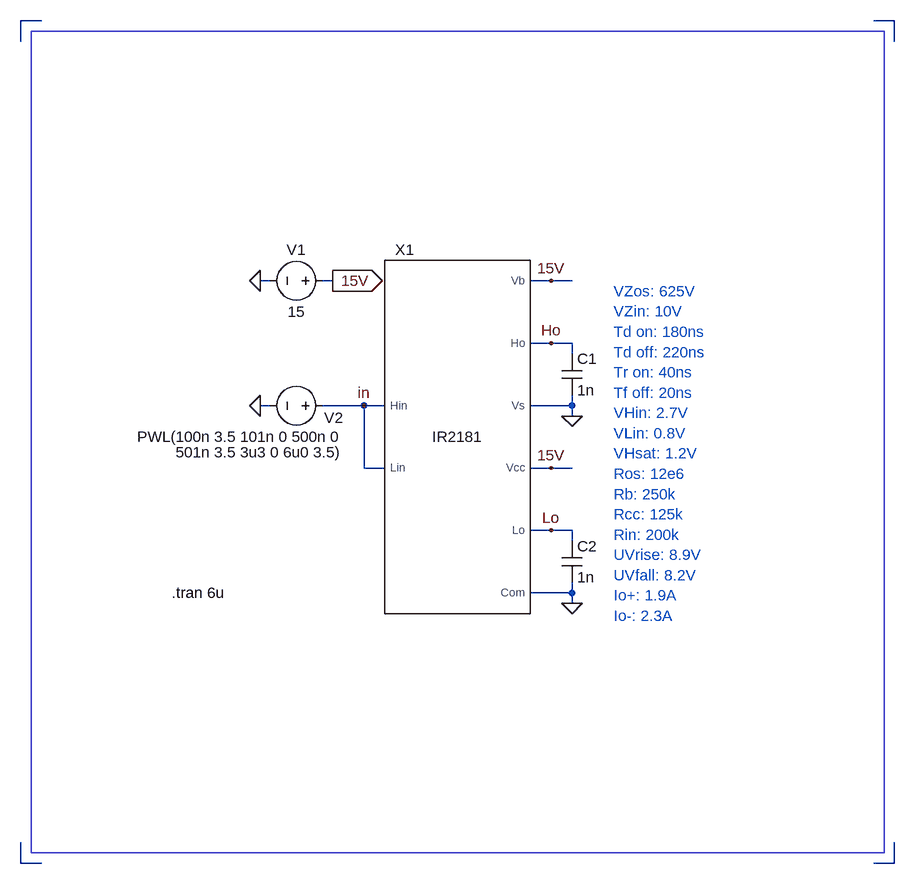
[diagram p0: schematic IR2181_test.asc]
IR2181_test.asc, the LTspice schematic file:
Version 4
SHEET 1 13828 1048
WIRE 752 -752 752 -784
WIRE 752 512 752 480
WIRE 784 -784 752 -784
WIRE 784 512 752 512
WIRE 1136 -384 1120 -384
WIRE 1136 -192 1120 -192
WIRE 1232 -384 1216 -384
WIRE 1280 -192 1216 -192
WIRE 1280 -96 1280 -192
WIRE 1312 -192 1280 -192
WIRE 1312 -96 1280 -96
WIRE 1568 -384 1536 -384
WIRE 1568 -288 1536 -288
WIRE 1568 -96 1536 -96
WIRE 1568 0 1536 0
WIRE 1600 -384 1568 -384
WIRE 1600 -288 1568 -288
WIRE 1600 -272 1600 -288
WIRE 1600 -192 1536 -192
WIRE 1600 -192 1600 -208
WIRE 1600 -176 1600 -192
WIRE 1600 -96 1568 -96
WIRE 1600 0 1568 0
WIRE 1600 16 1600 0
WIRE 1600 96 1536 96
WIRE 1600 96 1600 80
WIRE 1600 112 1600 96
WIRE 2096 -784 2064 -784
WIRE 2096 -752 2096 -784
WIRE 2096 512 2064 512
WIRE 2096 512 2096 480
FLAG 1600 -176 0
FLAG 1568 -288 Ho
FLAG 1600 112 0
FLAG 1568 0 Lo
FLAG 1568 -384 15V
FLAG 1568 -96 15V
FLAG 1232 -384 15V
IOPIN 1232 -384 Out
FLAG 1120 -384 0
FLAG 1120 -192 0
FLAG 1280 -192 in
SYMBOL cap 1584 -272 R0
SYMATTR InstName C1
SYMATTR Value 1n
SYMBOL cap 1584 16 R0
SYMATTR InstName C2
SYMATTR Value 1n
SYMBOL voltage 1232 -384 R90
WINDOW 0 -32 56 VBottom 0
WINDOW 3 32 56 VTop 0
SYMATTR InstName V1
SYMATTR Value 15
SYMBOL IR2181 1424 -144 R0
SYMATTR InstName X1
SYMBOL voltage 1232 -192 R90
WINDOW 0 19 -16 VRight 0
WINDOW 3 48 -16 VRight 0
WINDOW 123 72 -16 VRight 0
SYMATTR InstName V2
SYMATTR Value PWL(100n 3.5 101n 0 500n 0
SYMATTR Value2 501n 3.5 3u3 0 6u0 3.5)
TEXT 1664 -368 Left 0 ;VZos: 625V\nVZin: 10V\nTd on: 180ns\nTd off: 220ns\nTr on: 40ns\nTf off: 20ns\nVHin: 2.7V\nVLin: 0.8V\nVHsat: 1.2V\nRos: 12e6\nRb: 250k\nRcc: 125k\nRin: 200k\nUVrise: 8.9V\nUVfall: 8.2V\nIo+: 1.9A\nIo-: 2.3A
TEXT 984 96 Left 0 !.tran 6u
RECTANGLE Normal 2080 496 768 -768

The netlist it stands for:
* IR2181_test.asc
C1 Ho 0 1n
C2 Lo 0 1n
V1 15V 0 15
XX1 in in 0 Lo 15V 0 Ho 15V IR2181 params: IR2181  ; pins Hin Lin Com Lo Vcc Vs Ho Vb
V2 in 0 PWL(100n 3.5 101n 0 500n 0 501n 3.5 3u3 0 6u0 3.5)
* VZos: 625V
* VZin: 10V
* Td on: 180ns
* Td off: 220ns
* Tr on: 40ns
* Tf off: 20ns
* VHin: 2.7V
* VLin: 0.8V
* VHsat: 1.2V
* Ros: 12e6
* Rb: 250k
* Rcc: 125k
* Rin: 200k
* UVrise: 8.9V
* UVfall: 8.2V
* Io+: 1.9A
* Io-: 2.3A
.tran 6u
.backanno
.end